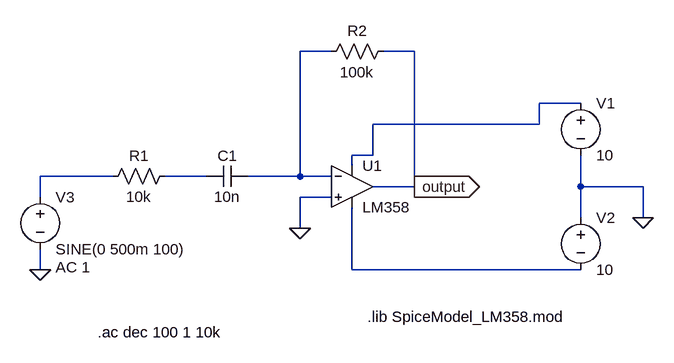
[diagram p0: schematic Filtro2.asc]
Filtro2.asc, the LTspice schematic file:
Version 4
SHEET 1 1256 680
WIRE 192 16 144 16
WIRE 320 16 272 16
WIRE 576 96 512 96
WIRE 512 128 512 96
WIRE 512 128 256 128
WIRE 256 176 256 128
WIRE 256 176 224 176
WIRE 224 192 224 176
WIRE -144 208 -256 208
WIRE 0 208 -64 208
WIRE 144 208 144 16
WIRE 144 208 64 208
WIRE 192 208 144 208
WIRE 320 224 320 16
WIRE 320 224 256 224
WIRE 576 224 576 176
WIRE 672 224 576 224
WIRE -256 240 -256 208
WIRE 192 240 144 240
WIRE 576 272 576 224
WIRE 672 272 672 224
WIRE 144 288 144 240
WIRE -256 352 -256 320
WIRE 224 352 224 256
WIRE 576 352 224 352
FLAG 144 288 0
FLAG -256 352 0
FLAG 672 272 0
FLAG 320 224 output
IOPIN 320 224 Out
SYMBOL res -48 192 R90
WINDOW 0 0 56 VBottom 2
WINDOW 3 32 56 VTop 2
SYMATTR InstName R1
SYMATTR Value 10k
SYMBOL res 288 0 R90
WINDOW 0 0 56 VBottom 2
WINDOW 3 32 56 VTop 2
SYMATTR InstName R2
SYMATTR Value 100k
SYMBOL cap 64 192 R90
WINDOW 0 0 32 VBottom 2
WINDOW 3 32 32 VTop 2
SYMATTR InstName C1
SYMATTR Value 10n
SYMBOL voltage 576 80 R0
WINDOW 123 0 0 Left 0
WINDOW 39 0 0 Left 0
SYMATTR InstName V1
SYMATTR Value 10
SYMBOL voltage 576 256 R0
WINDOW 123 0 0 Left 0
WINDOW 39 0 0 Left 0
SYMATTR InstName V2
SYMATTR Value 10
SYMBOL voltage -256 224 R0
WINDOW 123 24 124 Left 2
WINDOW 39 0 0 Left 0
SYMATTR Value2 AC 1
SYMATTR InstName V3
SYMATTR Value SINE(0 500m 100)
SYMBOL OpAmps\\opamp2 224 160 R0
SYMATTR InstName U1
SYMATTR Value LM358
TEXT 248 424 Left 2 !.lib SpiceModel_LM358.mod
TEXT -168 448 Left 2 !.ac dec 100 1 10k

The netlist it stands for:
* Filtro2.asc
R1 N004 N003 10k
R2 output N001 100k
C1 N001 N004 10n
V1 N002 0 10
V2 0 N005 10
V3 N003 0 SINE(0 500m 100) AC 1
XU1 0 N001 N002 N005 output LM358  ; pins In+ In- V+ V- OUT
.lib SpiceModel_LM358.mod
.ac dec 100 1 10k
.backanno
.end